# Altium schematic sheet 6_Pulse_Sensor.SchDoc
size A4
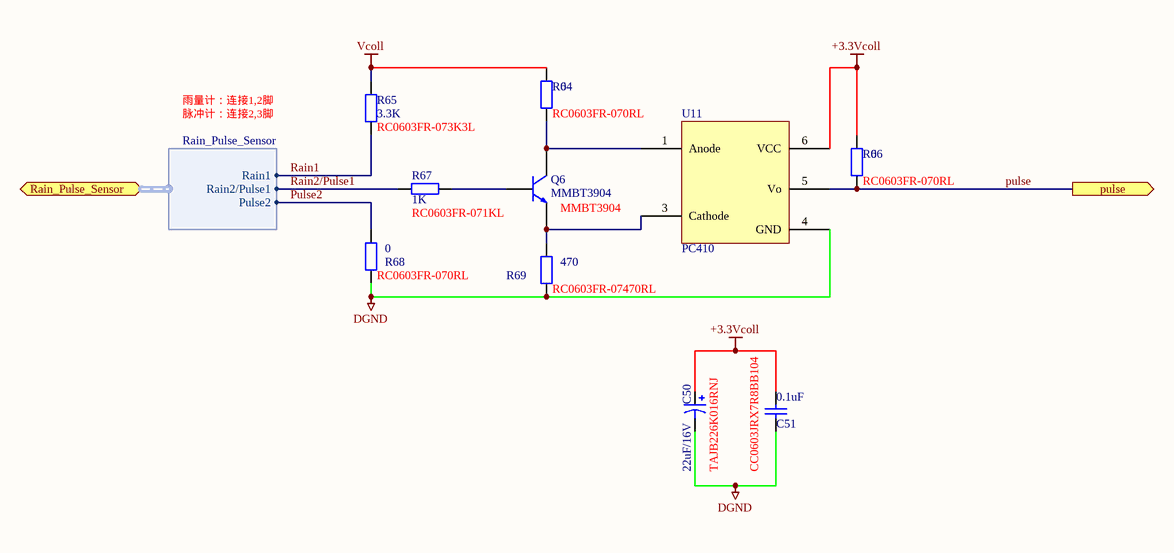
[diagram p0: 6_Pulse_Sensor.SchDoc]

## Parts
C50  22uF/16V  Part No.: TAJB226K016RNJ  [CB3528]
C51  0.1uF  Type No.: CC0603JRX7R8BB104  [CC0603]
Q6  MMBT3904  [SOT-23W]
R64  0  Type No.: RC0603FR-070RL  [CC0603]
R65  3.3K  Type No.: RC0603FR-073K3L  [CC0603]
R66  0  Type No.: RC0603FR-070RL  [CC0603]
R67  1K  Type No.: RC0603FR-071KL  [CC0603]
R68  0  Type No.: RC0603FR-070RL  [CC0603]
R69  470  Type No.: RC0603FR-07470RL  [CC0603]
U11  PC410  [PC410]

## Ports
pulse, Rain_Pulse_Sensor (harness Rain_Pulse_Sensor)

## Harnesses
Rain_Pulse_Sensor: Rain1, Rain2/Pulse1, Pulse2

## Nets
+3.3Vcoll: C50.1 C51.2 R66.1 U11.6(VCC)
DGND: C50.2 C51.1 R68.2 R69.2 U11.4(GND)
Vcoll: R64.1 R65.1
pulse: R66.2 U11.5(Vo) ; port pulse
Pulse2: R68.1 ; port Rain_Pulse_Sensor.Pulse2
Rain1: R65.2 ; port Rain_Pulse_Sensor.Rain1
Rain2/Pulse1: R67.1 ; port Rain_Pulse_Sensor.Rain2/Pulse1
NetQ6_1: Q6.1 R67.2
NetQ6_2: Q6.2 R69.1 U11.3(Cathode)
NetQ6_3: Q6.3 R64.2 U11.1(Anode)

## Notes on the sheet
- 雨量计：连接1,2脚
- 脉冲计：连接2,3脚
- 文件版本:
- 原理图名:
- 工 程  名:
- 绘       制:
- 审       核:
- 第   页，共    页
- 日       期:

## Library data of the parts
C50 = Cap Pol1: Polarized Capacitor (Radial)
C51 = Cap: Capacitor
Q6 = NPN: Type No.: MMBT3904
R64-R69 = Res2: Resistor